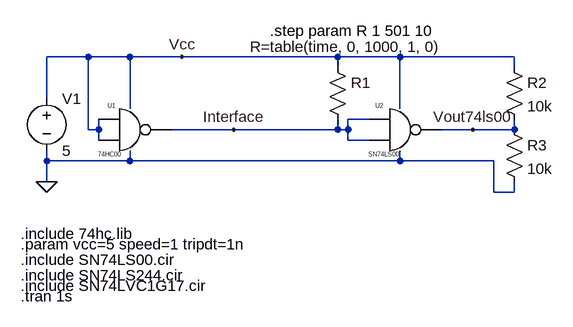
[diagram p0: schematic cmos-ttl_interface_sprint_0_user_story_1_1.asc]
cmos-ttl_interface_sprint_0_user_story_1_1.asc, the LTspice schematic file:
Version 4
SHEET 1 880 680
WIRE 48 -32 -16 -32
WIRE 112 -32 48 -32
WIRE 192 -32 112 -32
WIRE 432 -32 192 -32
WIRE 528 -32 432 -32
WIRE 704 -32 528 -32
WIRE 432 -16 432 -32
WIRE 704 -16 704 -32
WIRE -16 32 -16 -32
WIRE 112 48 112 -32
WIRE 528 48 528 -32
WIRE 480 64 448 64
WIRE 48 80 48 -32
WIRE 64 80 64 64
WIRE 64 80 48 80
WIRE 272 80 176 80
WIRE 432 80 432 64
WIRE 432 80 272 80
WIRE 448 80 448 64
WIRE 448 80 432 80
WIRE 640 80 592 80
WIRE 704 80 704 64
WIRE 704 80 640 80
WIRE 64 96 64 80
WIRE 448 96 448 80
WIRE 480 96 448 96
WIRE -16 128 -16 112
WIRE 112 128 112 112
WIRE 112 128 -16 128
WIRE 528 128 528 112
WIRE 528 128 112 128
WIRE 672 128 528 128
WIRE -16 160 -16 128
WIRE 672 176 672 128
WIRE 704 176 704 160
WIRE 704 176 672 176
FLAG -16 160 0
FLAG 192 -32 Vcc
FLAG 640 80 Vout74ls00
FLAG 272 80 Interface
SYMBOL voltage -16 16 R0
WINDOW 123 0 0 Left 0
WINDOW 39 0 0 Left 0
SYMATTR InstName V1
SYMATTR Value 5
SYMBOL 74hc00 112 16 R0
SYMATTR InstName U1
SYMBOL SN74LS00 528 16 R0
SYMATTR InstName U2
SYMBOL res 416 -32 R0
WINDOW 3 -119 -16 Left 2
SYMATTR Value R=table(time, 0, 1000, 1, 0)
SYMATTR InstName R1
SYMBOL res 688 -32 R0
SYMATTR InstName R2
SYMATTR Value 10k
SYMBOL res 688 64 R0
SYMATTR InstName R3
SYMATTR Value 10k
TEXT -56 240 Left 2 !.include 74hc.lib
TEXT -56 280 Left 2 !.include SN74LS00.cir
TEXT -56 336 Left 2 !.tran 1s
TEXT -56 256 Left 2 !.param vcc=5 speed=1 tripdt=1n
TEXT -56 304 Left 2 !.include SN74LS244.cir
TEXT 328 -72 Left 2 !.step param R 1 501 10
TEXT -56 320 Left 2 !.include SN74LVC1G17.cir

The netlist it stands for:
* cmos-ttl_interface_sprint_0_user_story_1_1.asc
V1 Vcc 0 5
XU1 Vcc Vcc Interface Vcc 0 74HC00 74HC00  ; pins A B Y VCC VGND
XU2 Vout74ls00 Interface Interface Vcc 0 SN74LS00 SN74LS00  ; pins Y A B VCC AGND
R1 Vcc Interface R=table(time, 0, 1000, 1, 0)
R2 Vcc Vout74ls00 10k
R3 Vout74ls00 0 10k
.include 74hc.lib
.include SN74LS00.cir
.tran 1s
.param vcc=5 speed=1 tripdt=1n
.include SN74LS244.cir
.step param R 1 501 10
.include SN74LVC1G17.cir
.lib 74hc.lib
.lib SN74LS00.cir
.backanno
.end

* Results of the author's LTspice run, read from the files saved beside the schematic
* Operating Point (first step), zero values left out:
*   r = 1 
*   V(vcc) = 5 V
*   V(interface) = 253.1 mV
*   V(vout74ls00) = 3.748 V
*   I(R1) = 4.747 mA
*   I(R2) = 125.2 µA
*   I(R3) = 374.8 µA
*   I(V1) = -5.138 mA
*   Ix(u1:A) = 50 nA
*   Ix(u1:B) = 50 nA
*   Ix(u1:Y) = 4.746 mA
*   Ix(u1:VGND) = -4.746 mA
*   Ix(u2:Y) = -249.7 µA
*   Ix(u2:A) = 368.2 nA
*   Ix(u2:B) = 368.2 nA
*   Ix(u2:VCC) = 266 µA
*   Ix(u2:AGND) = -17.07 µA
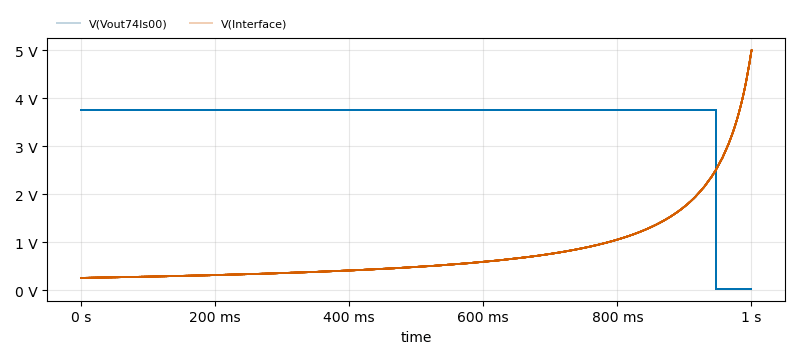
[diagram p1: Transient Analysis of cmos-ttl_interface_sprint_0_user_story_1_1.asc, plotted from the saved traces]
* Transient Analysis, 51 runs:
*   V(Vout74ls00) [run 1]: min 26.29 mV, max 3.748 V, average 3.55 V, rms 3.647 V, last 26.29 mV
*   V(Vout74ls00) [run 2]: min 26.29 mV, max 3.748 V, average 3.55 V, rms 3.647 V, last 26.29 mV
*   V(Vout74ls00) [run 3]: min 26.29 mV, max 3.748 V, average 3.55 V, rms 3.647 V, last 26.29 mV
*   V(Vout74ls00) [run 4]: min 26.29 mV, max 3.748 V, average 3.55 V, rms 3.647 V, last 26.29 mV
*   V(Vout74ls00) [run 5]: min 26.29 mV, max 3.748 V, average 3.55 V, rms 3.647 V, last 26.29 mV
*   V(Vout74ls00) [run 6]: min 26.29 mV, max 3.748 V, average 3.55 V, rms 3.647 V, last 26.29 mV
*   V(Vout74ls00) [run 7]: min 26.29 mV, max 3.748 V, average 3.55 V, rms 3.647 V, last 26.29 mV
*   V(Vout74ls00) [run 8]: min 26.29 mV, max 3.748 V, average 3.55 V, rms 3.647 V, last 26.29 mV
*   V(Interface) [run 1]: min 253.1 mV, max 5 V, average 796.2 mV, rms 1.126 V, last 5 V
*   V(Interface) [run 2]: min 253.1 mV, max 5 V, average 796.2 mV, rms 1.126 V, last 5 V
*   V(Interface) [run 3]: min 253.1 mV, max 5 V, average 796.2 mV, rms 1.126 V, last 5 V
*   V(Interface) [run 4]: min 253.1 mV, max 5 V, average 796.2 mV, rms 1.126 V, last 5 V
*   V(Interface) [run 5]: min 253.1 mV, max 5 V, average 796.2 mV, rms 1.126 V, last 5 V
*   V(Interface) [run 6]: min 253.1 mV, max 5 V, average 796.2 mV, rms 1.126 V, last 5 V
*   V(Interface) [run 7]: min 253.1 mV, max 5 V, average 796.2 mV, rms 1.126 V, last 5 V
*   V(Interface) [run 8]: min 253.1 mV, max 5 V, average 796.2 mV, rms 1.126 V, last 5 V